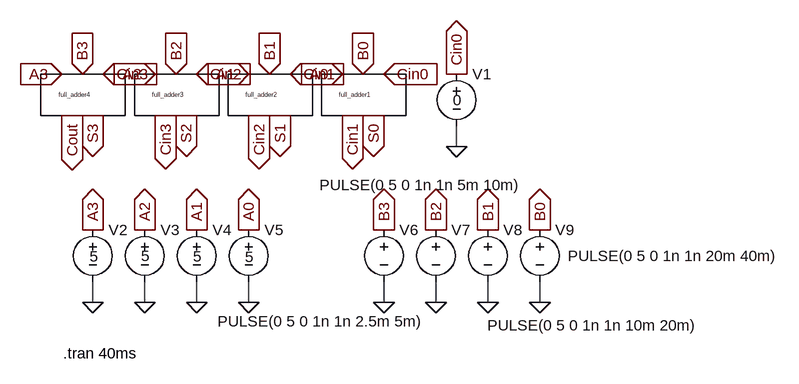
[diagram p0: schematic part2_simulatedCircuit.asc]
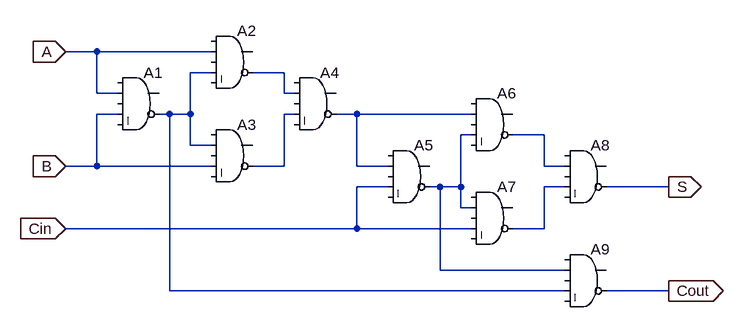
[diagram p1: sub-circuit part1_circuit.asc]
part2_simulatedCircuit.asc, the LTspice schematic file:
Version 4
SHEET 1 1028 680
WIRE 512 208 512 176
WIRE -48 448 -48 416
WIRE 32 448 32 416
WIRE 112 448 112 416
WIRE 192 448 192 416
WIRE 400 448 400 416
WIRE 480 448 480 416
WIRE 560 448 560 416
WIRE 640 448 640 416
FLAG 336 96 A0
IOPIN 336 96 In
FLAG 368 96 B0
IOPIN 368 96 In
FLAG 400 96 Cin0
IOPIN 400 96 In
FLAG 256 96 Cin1
IOPIN 256 96 In
FLAG 224 96 B1
IOPIN 224 96 In
FLAG 192 96 A1
IOPIN 192 96 In
FLAG 112 96 Cin2
IOPIN 112 96 In
FLAG 80 96 B2
IOPIN 80 96 In
FLAG 48 96 A2
IOPIN 48 96 In
FLAG -32 96 Cin3
IOPIN -32 96 In
FLAG -64 96 B3
IOPIN -64 96 In
FLAG -96 96 A3
IOPIN -96 96 In
FLAG -80 160 Cout
IOPIN -80 160 Out
FLAG -48 160 S3
IOPIN -48 160 Out
FLAG 64 160 Cin3
IOPIN 64 160 Out
FLAG 96 160 S2
IOPIN 96 160 Out
FLAG 208 160 Cin2
IOPIN 208 160 Out
FLAG 240 160 S1
IOPIN 240 160 Out
FLAG 352 160 Cin1
IOPIN 352 160 Out
FLAG 384 160 S0
IOPIN 384 160 Out
FLAG 512 208 0
FLAG 512 96 Cin0
IOPIN 512 96 Out
FLAG -48 448 0
FLAG 32 448 0
FLAG 112 448 0
FLAG 192 448 0
FLAG 400 448 0
FLAG 480 448 0
FLAG 560 448 0
FLAG 640 448 0
FLAG -48 336 A3
IOPIN -48 336 Out
FLAG 32 336 A2
IOPIN 32 336 Out
FLAG 112 336 A1
IOPIN 112 336 Out
FLAG 192 336 A0
IOPIN 192 336 Out
FLAG 400 336 B3
IOPIN 400 336 Out
FLAG 480 336 B2
IOPIN 480 336 Out
FLAG 560 336 B1
IOPIN 560 336 Out
FLAG 640 336 B0
IOPIN 640 336 Out
SYMBOL part1_circuit 368 128 R0
SYMATTR InstName full_adder1
SYMBOL part1_circuit 224 128 R0
SYMATTR InstName full_adder2
SYMBOL part1_circuit 80 128 R0
SYMATTR InstName full_adder3
SYMBOL part1_circuit -64 128 R0
SYMATTR InstName full_adder4
SYMBOL voltage 512 80 R0
WINDOW 3 -6 56 Left 2
WINDOW 123 0 0 Left 0
WINDOW 39 0 0 Left 0
SYMATTR InstName V1
SYMATTR Value 0
SYMBOL voltage -48 320 R0
WINDOW 3 -5 57 Left 2
WINDOW 123 0 0 Left 0
WINDOW 39 0 0 Left 0
SYMATTR InstName V2
SYMATTR Value 5
SYMBOL voltage 32 320 R0
WINDOW 3 -6 56 Left 2
WINDOW 123 0 0 Left 0
WINDOW 39 0 0 Left 0
SYMATTR InstName V3
SYMATTR Value 5
SYMBOL voltage 112 320 R0
WINDOW 3 -6 57 Left 2
WINDOW 123 0 0 Left 0
WINDOW 39 0 0 Left 0
SYMATTR InstName V4
SYMATTR Value 5
SYMBOL voltage 192 320 R0
WINDOW 3 -6 58 Left 2
WINDOW 123 0 0 Left 0
WINDOW 39 0 0 Left 0
SYMATTR InstName V5
SYMATTR Value 5
SYMBOL voltage 400 320 R0
WINDOW 3 -256 157 Left 2
WINDOW 123 0 0 Left 0
WINDOW 39 0 0 Left 0
SYMATTR InstName V6
SYMATTR Value PULSE(0 5 0 1n 1n 2.5m 5m)
SYMBOL voltage 480 320 R0
WINDOW 3 -179 -53 Left 2
WINDOW 123 0 0 Left 0
WINDOW 39 0 0 Left 0
SYMATTR InstName V7
SYMATTR Value PULSE(0 5 0 1n 1n 5m 10m)
SYMBOL voltage 560 320 R0
WINDOW 3 -1 163 Left 2
WINDOW 123 0 0 Left 0
WINDOW 39 0 0 Left 0
SYMATTR InstName V8
SYMATTR Value PULSE(0 5 0 1n 1n 10m 20m)
SYMBOL voltage 640 320 R0
WINDOW 3 43 56 Left 2
WINDOW 123 0 0 Left 0
WINDOW 39 0 0 Left 0
SYMATTR InstName V9
SYMATTR Value PULSE(0 5 0 1n 1n 20m 40m)
TEXT -94 526 Left 2 !.tran 40ms

part1_circuit.asc, the sub-circuit schematic file:
Version 4
SHEET 1 880 680
WIRE -128 32 -176 32
WIRE 48 32 -128 32
WIRE 48 64 16 64
WIRE 160 64 112 64
WIRE -128 96 -128 32
WIRE -96 96 -128 96
WIRE 160 96 160 64
WIRE 176 96 160 96
WIRE -96 128 -128 128
WIRE -16 128 -32 128
WIRE 16 128 16 64
WIRE 16 128 -16 128
WIRE 176 128 160 128
WIRE 272 128 240 128
WIRE 448 128 272 128
WIRE 448 160 432 160
WIRE 560 160 512 160
WIRE 16 176 16 128
WIRE 48 176 16 176
WIRE -128 208 -128 128
WIRE -128 208 -176 208
WIRE 48 208 -128 208
WIRE 160 208 160 128
WIRE 160 208 112 208
WIRE 272 208 272 128
WIRE 320 208 272 208
WIRE 560 208 560 160
WIRE 592 208 560 208
WIRE 320 240 272 240
WIRE 400 240 384 240
WIRE 432 240 432 160
WIRE 432 240 400 240
WIRE 592 240 560 240
WIRE 752 240 656 240
WIRE 432 272 432 240
WIRE 448 272 432 272
WIRE 272 304 272 240
WIRE 272 304 -176 304
WIRE 448 304 272 304
WIRE 560 304 560 240
WIRE 560 304 512 304
WIRE 400 368 400 240
WIRE 592 368 400 368
WIRE -16 400 -16 128
WIRE 592 400 -16 400
WIRE 752 400 656 400
FLAG -176 32 A
IOPIN -176 32 In
FLAG -176 208 B
IOPIN -176 208 In
FLAG -176 304 Cin
IOPIN -176 304 In
FLAG 752 240 S
IOPIN 752 240 Out
FLAG 752 400 Cout
IOPIN 752 400 Out
SYMBOL Digital\\and -64 48 R0
SYMATTR InstName A1
SYMBOL Digital\\and 80 -16 R0
SYMATTR InstName A2
SYMBOL Digital\\and 80 128 R0
SYMATTR InstName A3
SYMBOL Digital\\and 208 48 R0
SYMATTR InstName A4
SYMBOL Digital\\and 352 160 R0
SYMATTR InstName A5
SYMBOL Digital\\and 480 80 R0
SYMATTR InstName A6
SYMBOL Digital\\and 480 224 R0
SYMATTR InstName A7
SYMBOL Digital\\and 624 160 R0
SYMATTR InstName A8
SYMBOL Digital\\and 624 320 R0
SYMATTR InstName A9

The netlist it stands for:
* part2_simulatedCircuit.asc
Xfull_adder1 A0 B0 Cin0 Cin1 S0 part1_circuit
Xfull_adder2 A1 B1 Cin1 Cin2 S1 part1_circuit
Xfull_adder3 A2 B2 Cin2 Cin3 S2 part1_circuit
Xfull_adder4 A3 B3 Cin3 Cout S3 part1_circuit
V1 Cin0 0 0
V2 A3 0 5
V3 A2 0 5
V4 A1 0 5
V5 A0 0 5
V6 B3 0 PULSE(0 5 0 1n 1n 2.5m 5m)
V7 B2 0 PULSE(0 5 0 1n 1n 5m 10m)
V8 B1 0 PULSE(0 5 0 1n 1n 10m 20m)
V9 B0 0 PULSE(0 5 0 1n 1n 20m 40m)

* block symbol definitions
.subckt part1_circuit A B Cin Cout S
A1 0 A 0 B 0 N001 0 0 AND
A2 0 A 0 N001 0 N002 0 0 AND
A3 0 N001 0 B 0 N003 0 0 AND
A4 0 N002 0 N003 0 N004 0 0 AND
A5 0 N004 0 Cin 0 N005 0 0 AND
A6 0 N004 0 N005 0 N006 0 0 AND
A7 0 N005 0 Cin 0 N007 0 0 AND
A8 0 N006 0 N007 0 S 0 0 AND
A9 0 N005 0 N001 0 Cout 0 0 AND
.ends part1_circuit

.tran 40ms
.backanno
.end